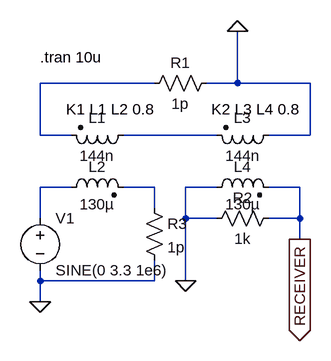
[diagram p0: schematic inductive-verySimple.asc]
inductive-verySimple.asc, the LTspice schematic file:
Version 4
SHEET 1 880 680
WIRE 144 16 -32 16
WIRE 272 16 272 -64
WIRE 272 16 224 16
WIRE 384 16 272 16
WIRE -32 96 -32 16
WIRE 16 96 -32 96
WIRE 240 96 96 96
WIRE 384 96 384 16
WIRE 384 96 320 96
WIRE 16 176 -32 176
WIRE 144 176 96 176
WIRE 240 176 192 176
WIRE 368 176 320 176
WIRE 144 208 144 176
WIRE -32 224 -32 176
WIRE 192 224 192 176
WIRE 240 224 192 224
WIRE 368 224 368 176
WIRE 368 224 320 224
WIRE 368 256 368 224
WIRE -32 320 -32 304
WIRE 144 320 144 288
WIRE 144 320 -32 320
WIRE 192 320 192 224
WIRE -32 352 -32 320
FLAG -32 352 0
FLAG 368 256 RECEIVER
IOPIN 368 256 Out
FLAG 192 320 0
FLAG 272 -64 0
SYMBOL ind2 112 80 R90
WINDOW 0 5 56 VBottom 2
WINDOW 3 32 56 VTop 2
SYMATTR InstName L1
SYMATTR Value 144n
SYMATTR Type ind
SYMBOL ind2 0 192 R270
WINDOW 0 32 56 VTop 2
WINDOW 3 5 56 VBottom 2
SYMATTR InstName L2
SYMATTR Value 130µ
SYMATTR Type ind
SYMBOL ind2 336 80 R90
WINDOW 0 5 56 VBottom 2
WINDOW 3 32 56 VTop 2
SYMATTR InstName L3
SYMATTR Value 144n
SYMATTR Type ind
SYMBOL ind2 224 192 R270
WINDOW 0 32 56 VTop 2
WINDOW 3 5 56 VBottom 2
SYMATTR InstName L4
SYMATTR Value 130µ
SYMATTR Type ind
SYMBOL res 240 0 R90
WINDOW 0 0 56 VBottom 2
WINDOW 3 32 56 VTop 2
SYMATTR InstName R1
SYMATTR Value 1p
SYMBOL voltage -32 208 R0
WINDOW 123 0 0 Left 2
WINDOW 39 0 0 Left 2
SYMATTR InstName V1
SYMATTR Value SINE(0 3.3 1e6)
SYMBOL res 336 208 R90
WINDOW 0 0 56 VBottom 2
WINDOW 3 32 56 VTop 2
SYMATTR InstName R2
SYMATTR Value 1k
SYMBOL res 128 192 R0
SYMATTR InstName R3
SYMATTR Value 1p
TEXT 8 56 Left 2 !K1 L1 L2 0.8
TEXT 232 56 Left 2 !K2 L3 L4 0.8
TEXT -32 -24 Left 2 !.tran 10u

The netlist it stands for:
* inductive-verySimple.asc
L1 N002 N001 144n
L2 N003 N004 130µ
L3 0 N002 144n
L4 0 RECEIVER 130µ
R1 0 N001 1p
V1 N003 0 SINE(0 3.3 1e6)
R2 RECEIVER 0 1k
R3 N004 0 1p
K1 L1 L2 0.8
K2 L3 L4 0.8
.tran 10u
.backanno
.end